# Altium schematic sheet temp_subtractor.SchDoc
size 599 x 299 mm
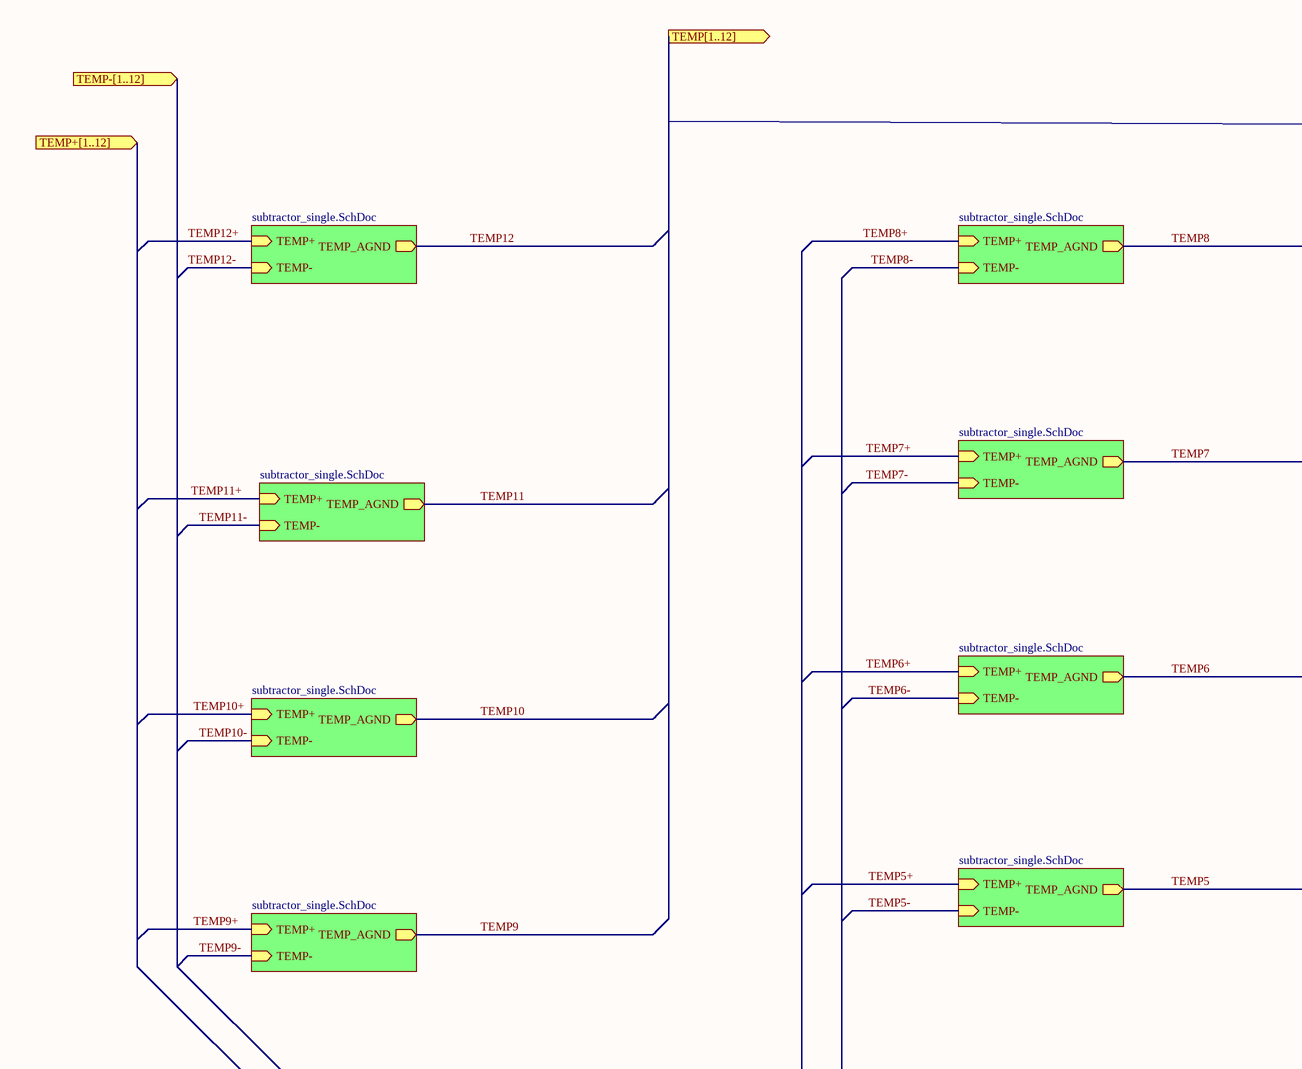
[diagram p0: temp_subtractor.SchDoc, left]
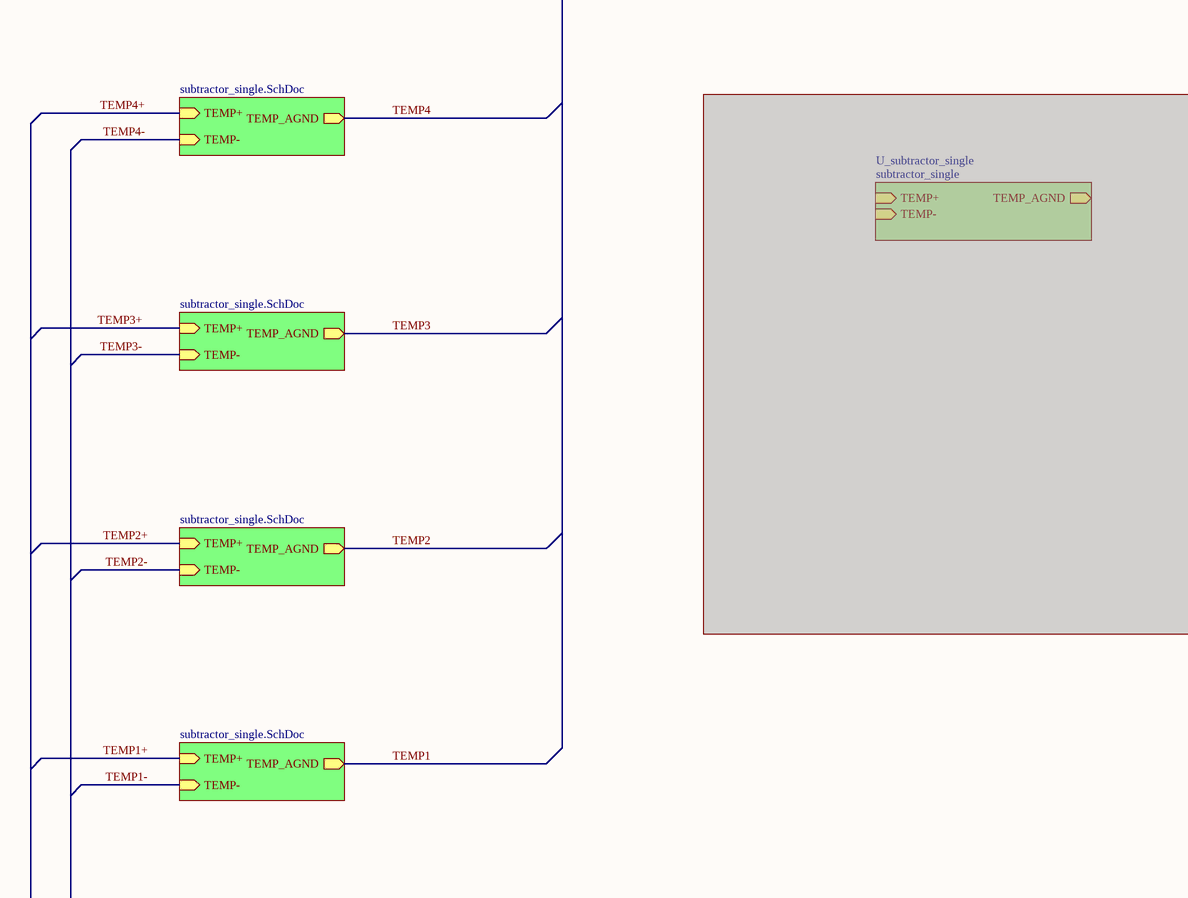
[diagram p1: temp_subtractor.SchDoc, right]

## Sub-sheets
Designator = subtractor_single.SchDoc: TEMP_AGND (out), TEMP+ (in), TEMP- (in)
Designator = subtractor_single.SchDoc: TEMP_AGND (out), TEMP+ (in), TEMP- (in)
Designator = subtractor_single.SchDoc: TEMP_AGND (out), TEMP+ (in), TEMP- (in)
Designator = subtractor_single.SchDoc: TEMP_AGND (out), TEMP+ (in), TEMP- (in)
Designator = subtractor_single.SchDoc: TEMP_AGND (out), TEMP+ (in), TEMP- (in)
Designator = subtractor_single.SchDoc: TEMP_AGND (out), TEMP+ (in), TEMP- (in)
Designator = subtractor_single.SchDoc: TEMP_AGND (out), TEMP+ (in), TEMP- (in)
Designator = subtractor_single.SchDoc: TEMP_AGND (out), TEMP+ (in), TEMP- (in)
Designator = subtractor_single.SchDoc: TEMP_AGND (out), TEMP+ (in), TEMP- (in)
Designator = subtractor_single.SchDoc: TEMP_AGND (out), TEMP+ (in), TEMP- (in)
Designator = subtractor_single.SchDoc: TEMP_AGND (out), TEMP+ (in), TEMP- (in)
Designator = subtractor_single.SchDoc: TEMP_AGND (out), TEMP+ (in), TEMP- (in)
U_subtractor_single = subtractor_single (masked out): TEMP+ (in), TEMP_AGND (out), TEMP- (in)

## Ports
TEMP+[1..12] (in), TEMP-[1..12] (in), TEMP[1..12] (out)

## Nets
TEMP1: sheet Designator/TEMP_AGND
TEMP1+: sheet Designator/TEMP+
TEMP1-: sheet Designator/TEMP-
TEMP2: sheet Designator/TEMP_AGND
TEMP2+: sheet Designator/TEMP+
TEMP2-: sheet Designator/TEMP-
TEMP3: sheet Designator/TEMP_AGND
TEMP3+: sheet Designator/TEMP+
TEMP3-: sheet Designator/TEMP-
TEMP4: sheet Designator/TEMP_AGND
TEMP4+: sheet Designator/TEMP+
TEMP4-: sheet Designator/TEMP-
TEMP5: sheet Designator/TEMP_AGND
TEMP5+: sheet Designator/TEMP+
TEMP5-: sheet Designator/TEMP-
TEMP6: sheet Designator/TEMP_AGND
TEMP6+: sheet Designator/TEMP+
TEMP6-: sheet Designator/TEMP-
TEMP7: sheet Designator/TEMP_AGND
TEMP7+: sheet Designator/TEMP+
TEMP7-: sheet Designator/TEMP-
TEMP8: sheet Designator/TEMP_AGND
TEMP8+: sheet Designator/TEMP+
TEMP8-: sheet Designator/TEMP-
TEMP9: sheet Designator/TEMP_AGND
TEMP9+: sheet Designator/TEMP+
TEMP9-: sheet Designator/TEMP-
TEMP10: sheet Designator/TEMP_AGND
TEMP10+: sheet Designator/TEMP+
TEMP10-: sheet Designator/TEMP-
TEMP11: sheet Designator/TEMP_AGND
TEMP11+: sheet Designator/TEMP+
TEMP11-: sheet Designator/TEMP-
TEMP12: sheet Designator/TEMP_AGND
TEMP12+: sheet Designator/TEMP+
TEMP12-: sheet Designator/TEMP-